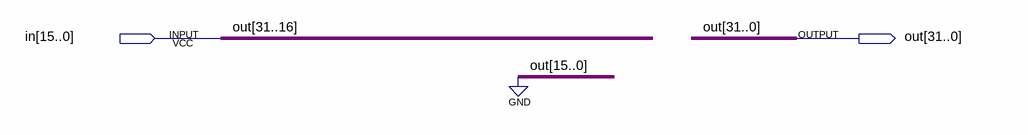
[diagram p0: schematic sheet]
// Quartus schematic lui32.bdf as structural Verilog: 0 symbols, 2 pins
module lui32 (
  input  [15:0] in,
  output [31:0] out
);


  assign out = {in, {16{1'b0}}};
endmodule
